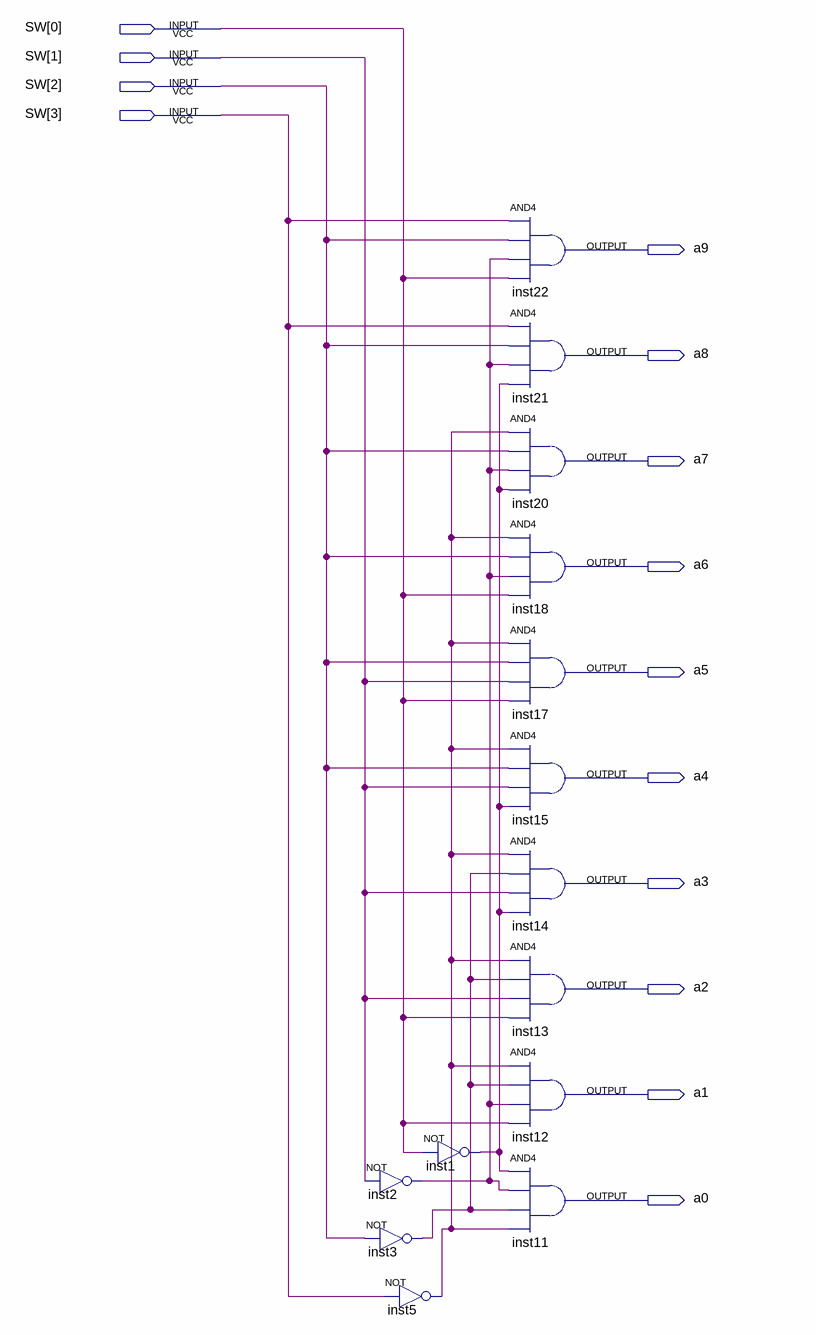
[diagram p0: schematic sheet]
// Quartus schematic decodificador.bdf as structural Verilog: 14 symbols, 14 pins
module decodificador (
  input  [3:0] SW,
  output a9,
  output a8,
  output a7,
  output a6,
  output a5,
  output a4,
  output a3,
  output a2,
  output a1,
  output a0
);

  wire inst1_out, inst2_out, inst3_out, inst5_out;

  not inst2 (inst2_out, SW[1]);
  not inst3 (inst3_out, SW[2]);
  not inst1 (inst1_out, SW[0]);
  not inst5 (inst5_out, SW[3]);
  and inst22 (a9, SW[3], SW[2], inst2_out, SW[0]);
  and inst21 (a8, SW[3], SW[2], inst2_out, inst1_out);
  and inst20 (a7, inst5_out, SW[2], inst2_out, inst1_out);
  and inst18 (a6, inst5_out, SW[2], inst2_out, SW[0]);
  and inst17 (a5, inst5_out, SW[2], SW[1], SW[0]);
  and inst15 (a4, inst5_out, SW[2], SW[1], inst1_out);
  and inst14 (a3, inst5_out, inst3_out, SW[1], inst1_out);
  and inst13 (a2, inst5_out, inst3_out, SW[1], SW[0]);
  and inst12 (a1, inst5_out, inst3_out, inst2_out, SW[0]);
  and inst11 (a0, inst1_out, inst2_out, inst3_out, inst5_out);
endmodule
